# Altium project GS-1.PrjPcb
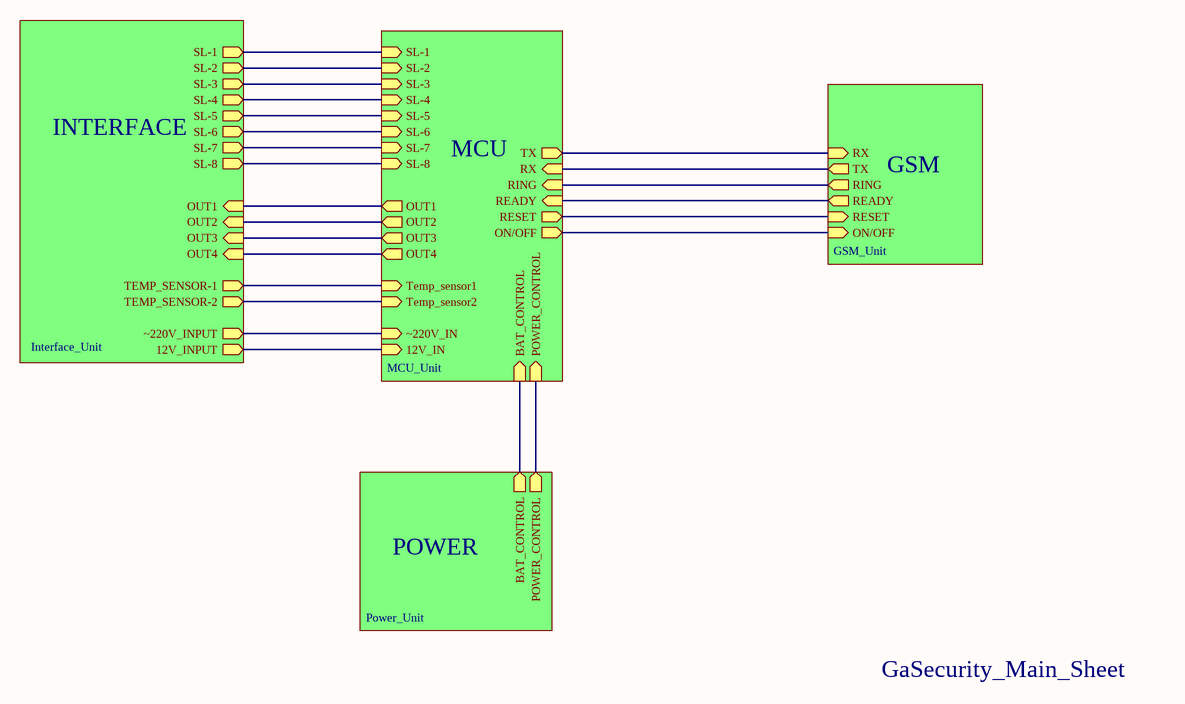
[diagram p0: GS-1.SchDoc]
5 sheets, 130 parts. Net scope: hierarchical (ports join the sheet entries above them; power ports are global).
Board file: GS-1.PcbDoc
Sheets:
  GS-1.SchDoc
    MCU = MCU_Unit.SchDoc
    POWER = Power_Unit.SchDoc
    GSM = GSM_Unit.SchDoc
    INTERFACE = Interface_Unit.SchDoc

## Sheet GS-1.SchDoc
size A4

### Sub-sheets
GSM = GSM_Unit: RX (in), TX (out), RING (out), READY (out), RESET (in), ON/OFF (in)
INTERFACE = Interface_Unit: SL-1 (out), SL-2 (out), SL-3 (out), SL-4 (out), SL-5 (out), SL-6 (out), SL-7 (out), SL-8 (out), OUT1 (in), OUT2 (in), OUT3 (in), OUT4 (in), TEMP_SENSOR-1 (out), TEMP_SENSOR-2 (out), ~220V_INPUT (out), 12V_INPUT (out)
MCU = MCU_Unit: TX (out), RX (in), ON/OFF (out), RESET (out), READY (in), RING (in), SL-1 (in), SL-2 (in), SL-3 (in), SL-4 (in), SL-5 (in), SL-6 (in), SL-7 (in), SL-8 (in), Temp_sensor1 (in), Temp_sensor2 (in), ~220V_IN (in), 12V_IN (in), OUT1 (out), OUT2 (out), OUT3 (out), OUT4 (out), BAT_CONTROL (in), POWER_CONTROL (in)
POWER = Power_Unit: POWER_CONTROL (out), BAT_CONTROL (out)

### Nets
NetC2_1: sheet MCU/12V_IN, sheet INTERFACE/12V_INPUT
NetC14_1: sheet MCU/POWER_CONTROL, sheet POWER/POWER_CONTROL
NetP17_2: sheet MCU/Temp_sensor1, sheet INTERFACE/TEMP_SENSOR-1
NetP18_2: sheet MCU/Temp_sensor2, sheet INTERFACE/TEMP_SENSOR-2
NetQ1_3: sheet MCU/RX, sheet GSM/TX
NetQ2_3: sheet MCU/TX, sheet GSM/RX
NetR5_1: sheet MCU/RESET, sheet GSM/RESET
NetR6_1: sheet MCU/ON/OFF, sheet GSM/ON/OFF
NetR9_2: sheet MCU/SL-5, sheet INTERFACE/SL-5
NetR10_2: sheet MCU/SL-1, sheet INTERFACE/SL-1
NetR23_1: sheet MCU/OUT3, sheet INTERFACE/OUT3
NetR24_1: sheet MCU/OUT4, sheet INTERFACE/OUT4
NetR25_2: sheet MCU/SL-6, sheet INTERFACE/SL-6
NetR26_2: sheet MCU/SL-2, sheet INTERFACE/SL-2
NetR27_1: sheet MCU/OUT1, sheet INTERFACE/OUT1
NetR28_1: sheet MCU/OUT2, sheet INTERFACE/OUT2
NetR32_2: sheet MCU/~220V_IN, sheet INTERFACE/~220V_INPUT
NetR35_2: sheet MCU/SL-7, sheet INTERFACE/SL-7
NetR36_2: sheet MCU/SL-3, sheet INTERFACE/SL-3
NetR42_2: sheet MCU/SL-8, sheet INTERFACE/SL-8
NetR43_2: sheet MCU/SL-4, sheet INTERFACE/SL-4
NetR54_1: sheet MCU/BAT_CONTROL, sheet POWER/BAT_CONTROL
NetU1_7: sheet MCU/READY, sheet GSM/READY
NetU1_45: sheet MCU/RING, sheet GSM/RING

### Notes on the sheet
- GaSecurity_Main_Sheet

## Sheet MCU_Unit.SchDoc
size A4
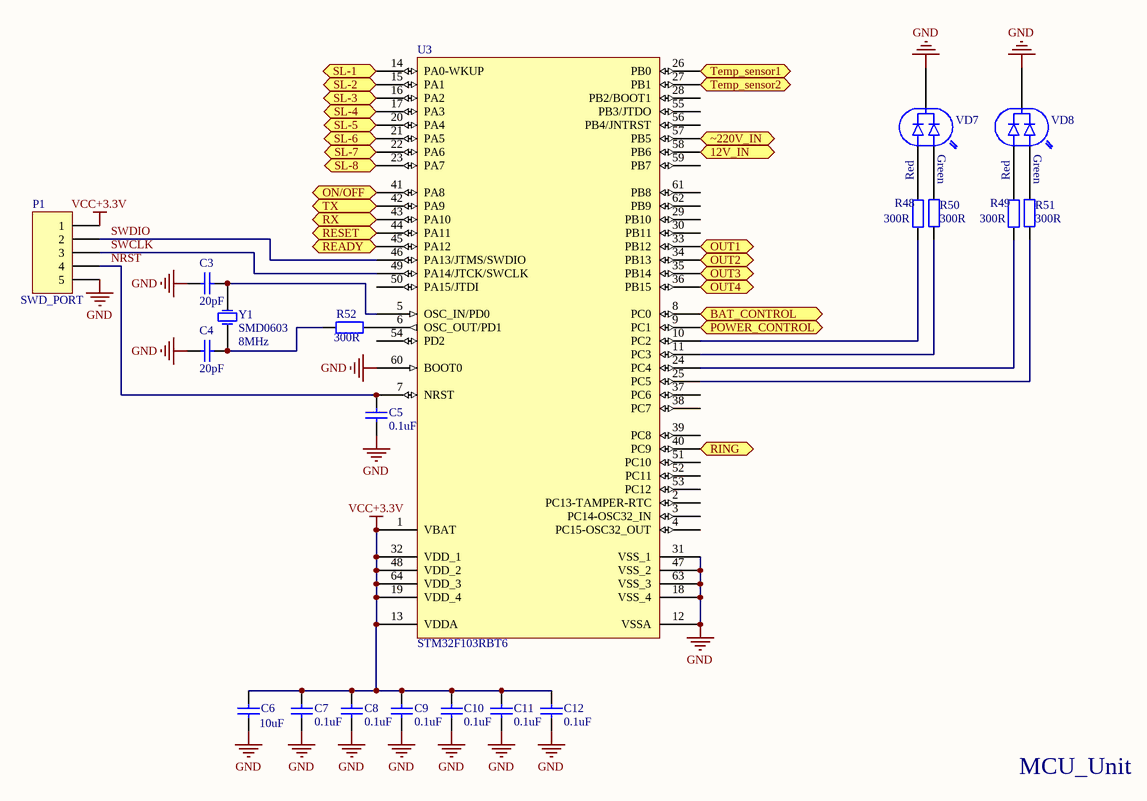
[diagram p1: MCU_Unit.SchDoc]

### Parts
C3  value 20pF  [C0603]  (hidden comment: CAP_SMD)
C4  value 20pF  [C0603]  (hidden comment: CAP_SMD)
C5  value 0.1uF  [C0603]  (hidden comment: CAP_SMD)
C6  value 10uF  [C1210]  (hidden comment: Cap Semi)
C7  value 0.1uF  [C0603]  (hidden comment: CAP_SMD)
C8  value 0.1uF  [C0603]  (hidden comment: CAP_SMD)
C9  value 0.1uF  [C0603]  (hidden comment: CAP_SMD)
C10  value 0.1uF  [C0603]  (hidden comment: CAP_SMD)
C11  value 0.1uF  [C0603]  (hidden comment: CAP_SMD)
C12  value 0.1uF  [C0603]  (hidden comment: CAP_SMD)
P1  SWD_PORT  [HDR1X5]
R48  value 300R  [C0603]  (hidden comment: RES_SMD)
R49  value 300R  [C0603]  (hidden comment: RES_SMD)
R50  value 300R  [C0603]  (hidden comment: RES_SMD)
R51  value 300R  [C0603]  (hidden comment: RES_SMD)
R52  value 300R  [C0603]  (hidden comment: RES_SMD)
U3  STM32F103RBT6  [LQFP64_N]
VD7  LIGHTDIODE2  [LIGHTDIODE2]  (value not drawn)
VD8  LIGHTDIODE2  [LIGHTDIODE2]  (value not drawn)
Y1  SMD0603  [Quartz_SMD0603]

### Ports
12V_IN (in), BAT_CONTROL (in), ON/OFF (out), OUT1 (out), OUT2 (out), OUT3 (out), OUT4 (out), POWER_CONTROL (in), READY (in), RESET (out), RING (in), RX (in), SL-1 (in), SL-2 (in), SL-3 (in), SL-4 (in), SL-5 (in), SL-6 (in), SL-7 (in), SL-8 (in), Temp_sensor1 (in), Temp_sensor2 (in), TX (out), ~220V_IN (in)

### Nets
GND: C3.1 C4.1 C5.2 C6.1 C7.2 C8.2 C9.2 C10.2 C11.2 C12.2 P1.5 U3.12(VSSA) U3.18(VSS_4) U3.31(VSS_1) U3.47(VSS_2) U3.60(BOOT0) U3.63(VSS_3) VD7.1 VD8.1
VCC+3.3V: C6.2 C7.1 C8.1 C9.1 C10.1 C11.1 C12.1 P1.1 U3.1(VBAT) U3.13(VDDA) U3.19(VDD_4) U3.32(VDD_1) U3.48(VDD_2) U3.64(VDD_3)
NRST: C5.1 P1.4 U3.7(NRST)
SWCLK: P1.3 U3.49(PA14/JTCK/SWCLK)
SWDIO: P1.2 U3.46(PA13/JTMS/SWDIO)
NetC2_1: U3.58(PB6) ; port 12V_IN
NetC3_2: C3.2 U3.5(OSC_IN/PD0) Y1.3(OSC2)
NetC4_2: C4.2 R52.1 Y1.1(OSC1)
NetC14_1: U3.9(PC1) ; port POWER_CONTROL
NetP17_2: U3.26(PB0) ; port Temp_sensor1
NetP18_2: U3.27(PB1) ; port Temp_sensor2
NetQ1_3: U3.43(PA10) ; port RX
NetQ2_3: U3.42(PA9) ; port TX
NetR5_1: U3.44(PA11) ; port RESET
NetR6_1: U3.41(PA8) ; port ON/OFF
NetR9_2: U3.20(PA4) ; port SL-5
NetR10_2: U3.14(PA0-WKUP) ; port SL-1
NetR23_1: U3.35(PB14) ; port OUT3
NetR24_1: U3.36(PB15) ; port OUT4
NetR25_2: U3.21(PA5) ; port SL-6
NetR26_2: U3.15(PA1) ; port SL-2
NetR27_1: U3.33(PB12) ; port OUT1
NetR28_1: U3.34(PB13) ; port OUT2
NetR32_2: U3.57(PB5) ; port ~220V_IN
NetR35_2: U3.22(PA6) ; port SL-7
NetR36_2: U3.16(PA2) ; port SL-3
NetR42_2: U3.23(PA7) ; port SL-8
NetR43_2: U3.17(PA3) ; port SL-4
NetR48_1: R48.1 U3.10(PC2)
NetR48_2: R48.2 VD7.3
NetR49_1: R49.1 U3.24(PC4)
NetR49_2: R49.2 VD8.3
NetR50_1: R50.1 U3.11(PC3)
NetR50_2: R50.2 VD7.2
NetR51_1: R51.1 U3.25(PC5)
NetR51_2: R51.2 VD8.2
NetR52_2: R52.2 U3.6(OSC_OUT/PD1)
NetR54_1: U3.8(PC0) ; port BAT_CONTROL
NetU1_7: U3.45(PA12) ; port READY
NetU1_45: U3.40(PC9) ; port RING

Not connected (* = marked no-connect by the designer): U3 2(PC13-TAMPER-RTC) 3(PC14-OSC32_IN) 4(PC15-OSC32_OUT) 28(PB2/BOOT1) 29(PB10) 30(PB11) 37(PC6) 38(PC7) 39(PC8) 50(PA15/JTDI) 51(PC10) 52(PC11) 53(PC12) 54(PD2) 55(PB3/JTDO) 56(PB4/JNTRST) 59(PB7) 61(PB8) 62(PB9)

### Notes on the sheet
- Green
- Red
- MCU_Unit
- (in symbol Quartz_SMD) 8MHz

### Library data of the parts
C3-C5 C7-C12 = Capasitor_SMD_0805: Capasitor_SMD_0808/
C6 = Cap Semi: Capacitor (Semiconductor SIM Model); Published: 8-Jun-2000; LatestRevisionDate: 29-May-2009; LatestRevisionNote: IPC-7351 Footprint Added.; PackageReference: C1206; Publisher: Altium Limited; PackageDescription: Chip Capacitor
P1 = Header 5: Header, 5-Pin; LatestRevisionDate: 17-Jul-2002; LatestRevisionNote: Re-released for DXP Platform.; Publisher: Altium Limited
R48-R52 = RES: Resistor
U3 = STM32F103RBT6: STM32 ARM-based 32-bit MCU with 128 Kbytes Flash, 64-pin LQFP, Industrial Temperature; Published: 30-May-2008; DatasheetVersion: rev6, Mar-2008; PackageVersion: Mar-2008; PackageReference: LQFP64; Publisher: Altium Limited; PackageDescription: 64-Pin Low-Profile Quad Flat Pack, 10 x 10 mm Body, 0.5 mm Pitch (LQFP64); ComponentLink1Description: Manufacturer Link; ComponentLink1URL: www.st.com/stm32; ComponentLink2Description: Datasheet; ComponentLink2URL: http://www.st.com/stonline/products/literature/ds/13587.pdf
Y1 = Quartz_SMD
VD7 VD8 = LIGHTDIODE2: Value: *

## Sheet Power_Unit.SchDoc
size A4
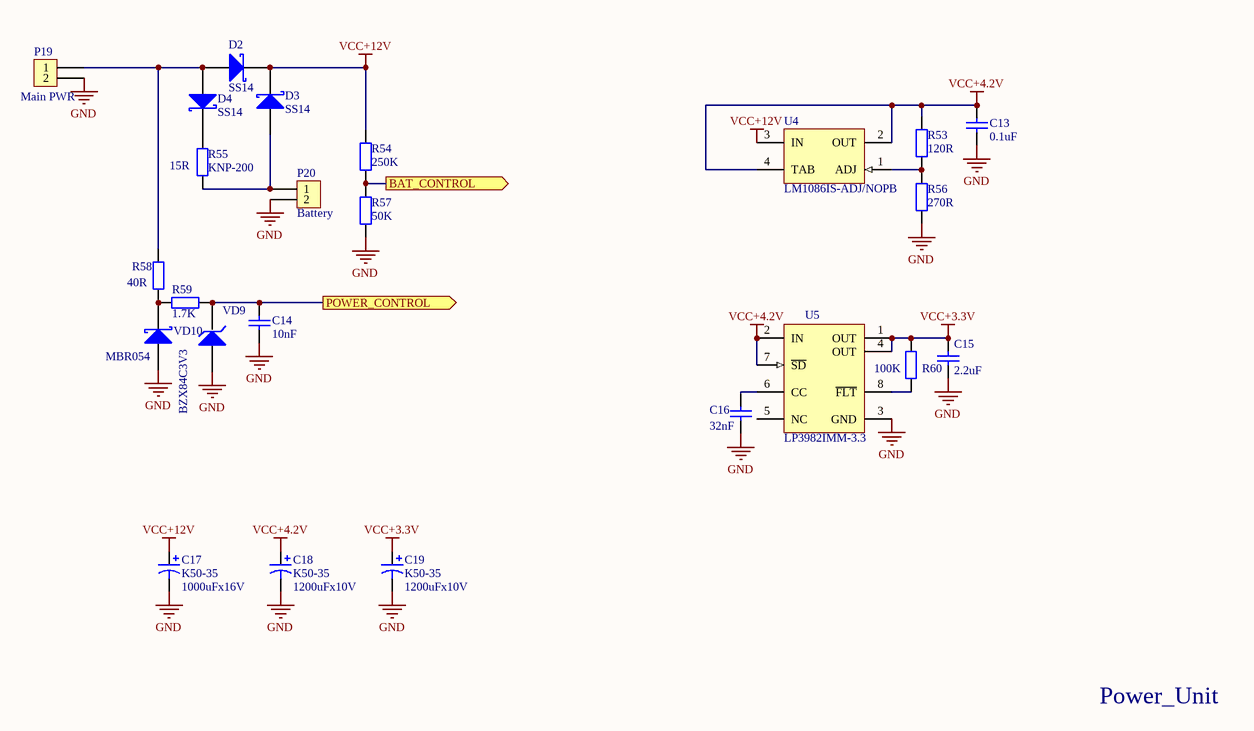
[diagram p2: Power_Unit.SchDoc]

### Parts
C13  value 0.1uF  [C0603]  (hidden comment: CAP_SMD)
C14  value 10nF  [C0603]  (hidden comment: 0805)
C15  value 2.2uF  [C0603]  (hidden comment: 0805)
C16  value 32nF  [C0603]  (hidden comment: 0805)
C17  K50-35  value 1000uFx16V  [CAP_POL_D10]
C18  K50-35  value 1200uFx10V  [CAP_POL_D10]
C19  K50-35  value 1200uFx10V  [CAP_POL_D10]
D2  SS14  [SMA_Diode]
D3  SS14  [SMA_Diode]
D4  SS14  [SMA_Diode]
P19  Main PWR  [WF 02M]
P20  Battery  [WF 02M]
R53  value 120R  [C0805]  (hidden comment: RES)
R54  value 250K  [C0603]  (hidden comment: RES_SMD)
R55  KNP-200  value 15R  [Resistor KNP-200]
R56  value 270R  [C0805]  (hidden comment: RES)
R57  value 50K  [C0603]  (hidden comment: RES_SMD)
R58  value 40R  [C0805]  (hidden comment: RES)
R59  value 1.7K  [C0805]  (hidden comment: RES)
R60  value 100K  [C0603]  (hidden comment: RES)
U4  LM1086IS-ADJ/NOPB  [TS3B_N]
U5  LP3982IMM-3.3  [MUA08A_N]
VD9  BZX84C3V3  [SOT23]
VD10  MBR054  [SOD-123]

### Ports
BAT_CONTROL (out), POWER_CONTROL (out)

### Nets
GND: C13.2 C14.2 C15.2 C16.2 C17.2 C18.2 C19.2 P19.2 P20.2 R56.1 R57.1 U5.3(GND) VD9.1(A) VD10.2(A)
VCC+3.3V: C15.1 C19.1 R60.2 U5.1(OUT) U5.4(OUT)
VCC+4.2V: C13.1 C18.1 R53.2 U4.2(OUT) U4.4(TAB) U5.2(IN) U5.7(~{SD})
VCC+12V: C17.1 D2.1(K) D3.1(K) R54.2 U4.3(IN)
NetC14_1: C14.1 R59.2 VD9.3(K) ; port POWER_CONTROL
NetC16_1: C16.1 U5.6(CC)
NetD2_2: D2.2(A) D4.2(A) P19.1 R58.2
NetD3_2: D3.2(A) P20.1 R55.1
NetD4_1: D4.1(K) R55.2
NetR53_1: R53.1 R56.2 U4.1(ADJ)
NetR54_1: R54.1 R57.2 ; port BAT_CONTROL
NetR58_1: R58.1 R59.1 VD10.1(K)
NetR60_1: R60.1 U5.8(~{FLT})

Not connected (* = marked no-connect by the designer): U5 5(NC); VD9 2

### Notes on the sheet
- Power_Unit

### Library data of the parts
C13-C16 = Capasitor_SMD_0805: Capasitor_SMD_0808/
C17-C19 = Capasitor_pol D10
P19 P20 = WF 02M
R53 R54 R56-R60 = RES: Resistor
R55 = Resistor 2W
U4 = LM1086IS-ADJ/NOPB: 1.5A Low Dropout Positive Regulators, 3-pin TO-263, Pb-Free; Manufacturer: National Semiconductor; PackageTopMarking: NSUZXYTTE#*LM1086*IS-ADJ; PowerWise: N; CompType: LDO IC; Published: 1-Mar-2010; DatasheetVersion: Jun-2005; PackageVersion: revF, Apr-2005; PackageReference: TS3B; Publisher: Altium Limited; PackageDescription: TO-263, Molded, .400 x .390 x .180in, 3 Lead, .1in Pitch, Surface Mount; Supplier 1: Digi-Key; Supplier Part Number 1: LM1086IS-ADJ-ND; Supplier 2: Farnell; Supplier Part Number 2: 1469045; PartNumber: LM1086IS-ADJ/NOPB; RoHS: Y; PinCount: 3; Code_JEDEC: MO-169-AA; ComponentLink1Description: LM1086 Datasheet; ComponentLink1URL: http://www.national.com/ds/LM/LM1086.pdf; ComponentLink2Description: LM1086 Web Page; ComponentLink2URL: http://www.national.com/pf/LM/LM1086.html; ComponentLink3Description: TS3B Package Page; ComponentLink3URL: http://www.national.com/packaging/folders/ts3b.html
U5 = LP3982IMM-3.3: Micropower, Ultra Low-Dropout, Low-Noise, 300mA CMOS Regulator, 8-pin Mini SOIC; Manufacturer: National Semiconductor; PackageTopMarking: ZXTT*LEUB; PowerWise: N; CompType: LDO IC; Published: 4-Dec-2008; DatasheetVersion: Mar-2006; PackageVersion: revF, Apr-2008; PackageReference: MUA08A; Publisher: Altium Limited; PackageDescription: MINI SOIC, .118 x .118 x .034in, 8 Lead, .0256in Pitch; Supplier 1: Farnell; Supplier Part Number 1: 9779590; PartNumber: LP3982IMM-3.3; RoHS: N; PinCount: 8; Code_JEDEC: MO-187-AA; ComponentLink1Description: LP3982 Datasheet; ComponentLink1URL: http://www.national.com/ds/LP/LP3982.pdf; ComponentLink2Description: LP3982 Web Page; ComponentLink2URL: http://www.national.com/pf/LP/LP3982.html; ComponentLink3Description: MUA08A Package Page; ComponentLink3URL: http://www.national.com/packaging/folders/mua08a.html
VD9 = BZX84C: Value: *

## Sheet GSM_Unit.SchDoc
size A4
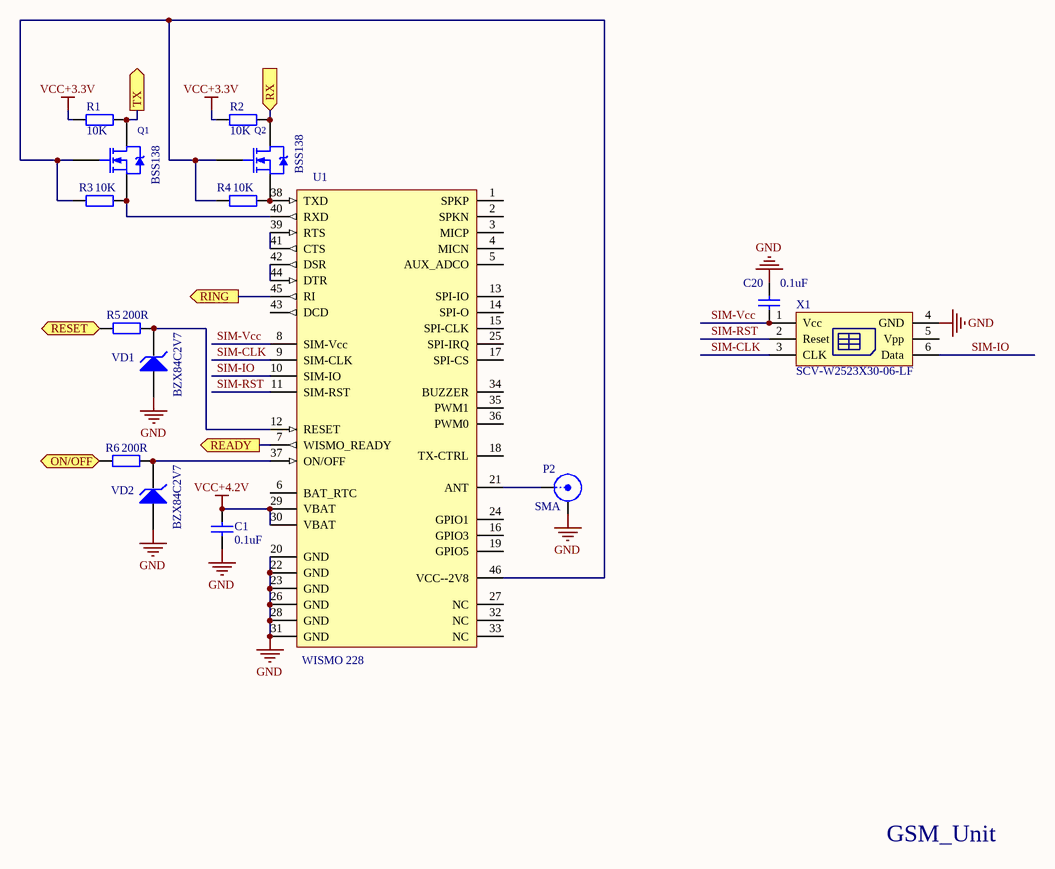
[diagram p3: GSM_Unit.SchDoc]

### Parts
C1  value 0.1uF  [C0603]  (hidden comment: CAP_SMD)
C20  value 0.1uF  [C0603]  (hidden comment: CAP_SMD)
P2  SMA  [SMA]
Q1  BSS138  [SOT23]
Q2  BSS138  [SOT23]
R1  value 10K  [C0603]  (hidden comment: RES_SMD)
R2  value 10K  [C0603]  (hidden comment: RES_SMD)
R3  value 10K  [C0603]  (hidden comment: RES_SMD)
R4  value 10K  [C0603]  (hidden comment: RES_SMD)
R5  value 200R  [C0603]  (hidden comment: RES_SMD)
R6  value 200R  [C0603]  (hidden comment: RES_SMD)
U1  WISMO 228  [WISMO]
VD1  BZX84C2V7  [SOT23]
VD2  BZX84C2V7  [SOT23]
X1  SCV-W2523X30-06-LF  [SCV-W2523X30-06-LF]

### Ports
ON/OFF (in), READY (out), RESET (in), RING (out), RX (in), TX (out)

### Nets
GND: C1.2 C20.1 P2.2(Y) U1.20(GND) U1.22(GND) U1.23(GND) U1.26(GND) U1.28(GND) U1.31(GND) VD1.1(A) VD2.1(A) X1.4(GND)
VCC+3.3V: R1.1 R2.1
VCC+4.2V: C1.1 U1.29(VBAT) U1.30(VBAT)
SIM-CLK: U1.9(SIM-CLK) X1.3(CLK)
SIM-IO: U1.10(SIM-IO) X1.6(Data)
SIM-RST: U1.11(SIM-RST) X1.2(Reset)
SIM-Vcc: C20.2 U1.8(SIM-Vcc) X1.1(Vcc)
NetP2_1: P2.1(X) U1.21(ANT)
NetQ1_1: Q1.1(G) Q2.1(G) R3.1 R4.1 U1.46(VCC--2V8)
NetQ1_2: Q1.2(S) R3.2 U1.40(RXD)
NetQ1_3: Q1.3(D) R1.2 ; port TX
NetQ2_2: Q2.2(S) R4.2 U1.38(TXD)
NetQ2_3: Q2.3(D) R2.2 ; port RX
NetR5_1: R5.1 ; port RESET
NetR5_2: R5.2 U1.12(RESET) VD1.3(K)
NetR6_1: R6.1 ; port ON/OFF
NetR6_2: R6.2 U1.37(ON/OFF) VD2.3(K)
NetU1_7: U1.7(WISMO_READY) ; port READY
NetU1_39: U1.39(RTS) U1.41(CTS)
NetU1_42: U1.42(DSR) U1.44(DTR)
NetU1_45: U1.45(RI) ; port RING

Not connected (* = marked no-connect by the designer): U1 1(SPKP) 2(SPKN) 3(MICP) 4(MICN) 5(AUX_ADCO) 6(BAT_RTC) 13(SPI-IO) 14(SPI-O) 15(SPI-CLK) 16(GPIO3) 17(SPI-CS) 18(TX-CTRL) 19(GPIO5) 24(GPIO1) 25(SPI-IRQ) 27(NC) 32(NC) 33(NC) 34(BUZZER) 35(PWM1) 36(PWM0) 43(DCD); VD1 2; VD2 2; X1 5(Vpp)

### Notes on the sheet
- GSM_Unit

### Library data of the parts
C1 C20 = Capasitor_SMD_0805: Capasitor_SMD_0808/
Q1 Q2 = BSS138-SOT23
R1-R6 = RES: Resistor
VD1 VD2 = BZX84C: Value: *
X1 = SCV-W2523X30-06-LF: SIM Cartreader
P2 = SMA: LatestRevisionDate: 17-Jul-2002; Publisher: Altium Limited; LatestRevisionNote: Re-released for DXP Platform.; Value: *

## Sheet Interface_Unit.SchDoc
size A4
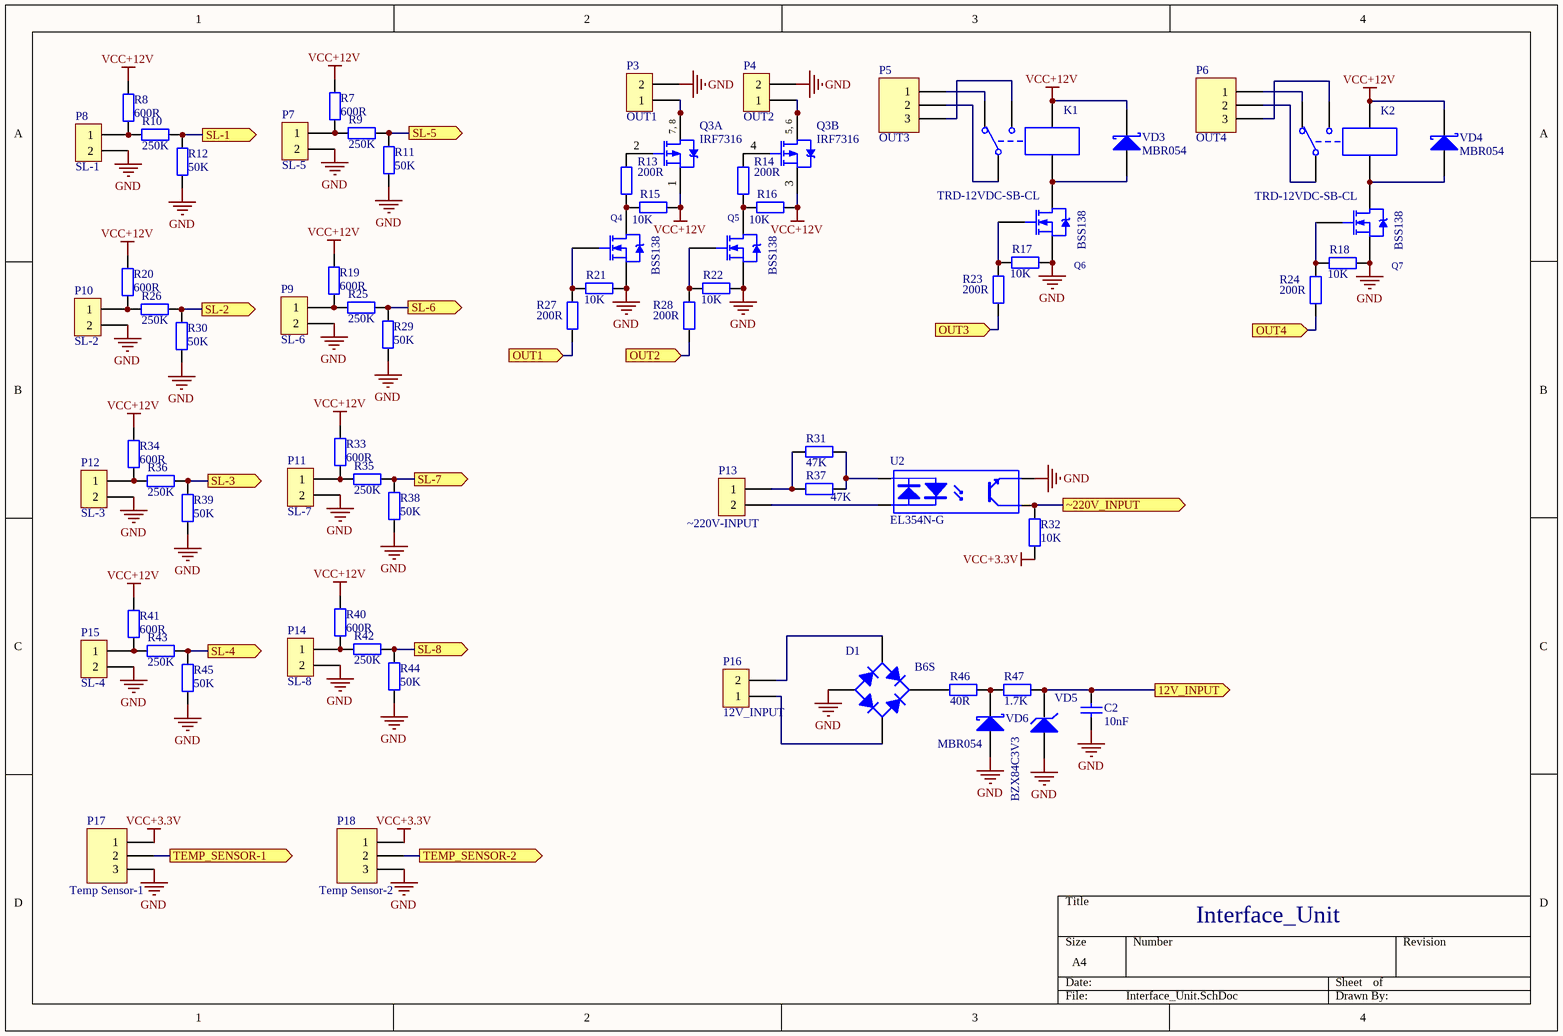
[diagram p4: Interface_Unit.SchDoc]

### Parts
C2  value 10nF  [C0603]  (hidden comment: 0805)
D1  B6S  [B6S]
K1  TRD-12VDC-SB-CL  [TRD-C Type]
K2  TRD-12VDC-SB-CL  [TRD-C Type]
P3  15EDGRC-3.5-02P  [15EDGRC-3.5-02P]  (value not drawn)
P4  15EDGRC-3.5-02P  [15EDGRC-3.5-02P]  (value not drawn)
P5  OUT3  [15EDGRC-3.5-03P]
P6  OUT4  [15EDGRC-3.5-03P]
P7  15EDGRC-3.5-02P  [15EDGRC-3.5-02P]  (value not drawn)
P8  15EDGRC-3.5-02P  [15EDGRC-3.5-02P]  (value not drawn)
P9  15EDGRC-3.5-02P  [15EDGRC-3.5-02P]  (value not drawn)
P10  15EDGRC-3.5-02P  [15EDGRC-3.5-02P]  (value not drawn)
P11  15EDGRC-3.5-02P  [15EDGRC-3.5-02P]  (value not drawn)
P12  15EDGRC-3.5-02P  [15EDGRC-3.5-02P]  (value not drawn)
P13  15EDGRC-3.5-02P  [15EDGRC-3.5-02P]  (value not drawn)
P14  15EDGRC-3.5-02P  [15EDGRC-3.5-02P]  (value not drawn)
P15  15EDGRC-3.5-02P  [15EDGRC-3.5-02P]  (value not drawn)
P16  15EDGRC-3.5-02P  [15EDGRC-3.5-02P]  (value not drawn)
P17  Temp Sensor-1  [15EDGRC-3.5-03P]
P18  Temp Sensor-2  [15EDGRC-3.5-03P]
Q3  IRF7316  [SO-8_N]  (parts A,B of 2)
Q4  BSS138  [SOT23]
Q5  BSS138  [SOT23]
Q6  BSS138  [SOT23]
Q7  BSS138  [SOT23]
R7  value 600R  [SMD-1206]  (hidden comment: RES_SMD)
R8  value 600R  [SMD-1206]  (hidden comment: RES_SMD)
R9  value 250K  [C0603]  (hidden comment: RES_SMD)
R10  value 250K  [C0603]  (hidden comment: RES_SMD)
R11  value 50K  [C0603]  (hidden comment: RES_SMD)
R12  value 50K  [C0603]  (hidden comment: RES_SMD)
R13  value 200R  [C0603]  (hidden comment: RES_SMD)
R14  value 200R  [C0603]  (hidden comment: RES_SMD)
R15  value 10K  [C0603]  (hidden comment: RES_SMD)
R16  value 10K  [C0603]  (hidden comment: RES_SMD)
R17  value 10K  [C0603]  (hidden comment: RES_SMD)
R18  value 10K  [C0603]  (hidden comment: RES_SMD)
R19  value 600R  [SMD-1206]  (hidden comment: RES_SMD)
R20  value 600R  [SMD-1206]  (hidden comment: RES_SMD)
R21  value 10K  [C0603]  (hidden comment: RES_SMD)
R22  value 10K  [C0603]  (hidden comment: RES_SMD)
R23  value 200R  [C0603]  (hidden comment: RES_SMD)
R24  value 200R  [C0603]  (hidden comment: RES_SMD)
R25  value 250K  [C0603]  (hidden comment: RES_SMD)
R26  value 250K  [C0603]  (hidden comment: RES_SMD)
R27  value 200R  [C0603]  (hidden comment: RES_SMD)
R28  value 200R  [C0603]  (hidden comment: RES_SMD)
R29  value 50K  [C0603]  (hidden comment: RES_SMD)
R30  value 50K  [C0603]  (hidden comment: RES_SMD)
R31  value 47K  [SMD-2512]  (hidden comment: RES_SMD)
R32  value 10K  [C0603]  (hidden comment: RES_SMD)
R33  value 600R  [SMD-1206]  (hidden comment: RES_SMD)
R34  value 600R  [SMD-1206]  (hidden comment: RES_SMD)
R35  value 250K  [C0603]  (hidden comment: RES_SMD)
R36  value 250K  [C0603]  (hidden comment: RES_SMD)
R37  value 47K  [SMD-2512]  (hidden comment: RES_SMD)
R38  value 50K  [C0603]  (hidden comment: RES_SMD)
R39  value 50K  [C0603]  (hidden comment: RES_SMD)
R40  value 600R  [SMD-1206]  (hidden comment: RES_SMD)
R41  value 600R  [SMD-1206]  (hidden comment: RES_SMD)
R42  value 250K  [C0603]  (hidden comment: RES_SMD)
R43  value 250K  [C0603]  (hidden comment: RES_SMD)
R44  value 50K  [C0603]  (hidden comment: RES_SMD)
R45  value 50K  [C0603]  (hidden comment: RES_SMD)
R46  value 40R  [C0805]  (hidden comment: RES)
R47  value 1.7K  [C0805]  (hidden comment: RES)
U2  EL354N-G  [EL354N-G]
VD3  MBR054  [SOD-123]
VD4  MBR054  [SOD-123]
VD5  BZX84C3V3  [SOT23]
VD6  MBR054  [SOD-123]

### Ports
12V_INPUT (out), OUT1 (in), OUT2 (in), OUT3 (in), OUT4 (in), SL-1 (out), SL-2 (out), SL-3 (out), SL-4 (out), SL-5 (out), SL-6 (out), SL-7 (out), SL-8 (out), TEMP_SENSOR-1 (out), TEMP_SENSOR-2 (out), ~220V_INPUT (out)

### Nets
GND: C2.2 D1.3(A) P3.2 P4.2 P7.2 P8.2 P9.2 P10.2 P11.2 P12.2 P14.2 P15.2 P17.3 P18.3 Q4.2(S) Q5.2(S) Q6.2(S) Q7.2(S) R11.1 R12.1 R17.2 R18.2 R21.2 R22.2 R29.1 R30.1 R38.1 R39.1 R44.1 R45.1 U2.3 VD5.1(A) VD6.2(A)
VCC+3.3V: P17.1 P18.1 R32.1
VCC+12V: K1.2 K2.2 Q3.1(S) Q3.3(S) R7.2 R8.2 R15.2 R16.2 R19.2 R20.2 R33.2 R34.2 R40.2 R41.2 VD3.1(K) VD4.1(K)
NetC2_1: C2.1 R47.2 VD5.3(K) ; port 12V_INPUT
NetD1_1: D1.1(K) R46.1
NetD1_2: D1.2(C) P16.1
NetD1_4: D1.4(C) P16.2
NetK1_1: K1.1 Q6.3(D) VD3.2(A)
NetK1_3: K1.3 P5.2
NetK1_4: K1.4 P5.1
NetK1_5: K1.5 P5.3
NetK2_1: K2.1 Q7.3(D) VD4.2(A)
NetK2_3: K2.3 P6.2
NetK2_4: K2.4 P6.1
NetK2_5: K2.5 P6.3
NetP3_1: P3.1 Q3.7(D) Q3.8(D)
NetP4_1: P4.1 Q3.5(D) Q3.6(D)
NetP7_1: P7.1 R7.1 R9.1
NetP8_1: P8.1 R8.1 R10.1
NetP9_1: P9.1 R19.1 R25.1
NetP10_1: P10.1 R20.1 R26.1
NetP11_1: P11.1 R33.1 R35.1
NetP12_1: P12.1 R34.1 R36.1
NetP13_1: P13.1 R31.1 R37.1
NetP13_2: P13.2 U2.1
NetP14_1: P14.1 R40.1 R42.1
NetP15_1: P15.1 R41.1 R43.1
NetP17_2: P17.2 ; port TEMP_SENSOR-1
NetP18_2: P18.2 ; port TEMP_SENSOR-2
NetQ3_2: Q3.2(G) R13.2
NetQ3_4: Q3.4(G) R14.2
NetQ4_1: Q4.1(G) R21.1 R27.2
NetQ4_3: Q4.3(D) R13.1 R15.1
NetQ5_1: Q5.1(G) R22.1 R28.2
NetQ5_3: Q5.3(D) R14.1 R16.1
NetQ6_1: Q6.1(G) R17.1 R23.2
NetQ7_1: Q7.1(G) R18.1 R24.2
NetR9_2: R9.2 R11.2 ; port SL-5
NetR10_2: R10.2 R12.2 ; port SL-1
NetR23_1: R23.1 ; port OUT3
NetR24_1: R24.1 ; port OUT4
NetR25_2: R25.2 R29.2 ; port SL-6
NetR26_2: R26.2 R30.2 ; port SL-2
NetR27_1: R27.1 ; port OUT1
NetR28_1: R28.1 ; port OUT2
NetR31_2: R31.2 R37.2 U2.2
NetR32_2: R32.2 U2.4 ; port ~220V_INPUT
NetR35_2: R35.2 R38.2 ; port SL-7
NetR36_2: R36.2 R39.2 ; port SL-3
NetR42_2: R42.2 R44.2 ; port SL-8
NetR43_2: R43.2 R45.2 ; port SL-4
NetR46_2: R46.2 R47.1 VD6.1(K)

Not connected (* = marked no-connect by the designer): VD5 2

### Notes on the sheet
- Interface_Unit
- (in symbol 15EDGRC-3.5-02P) SL-1; SL-2; SL-3; SL-4; SL-5; SL-6; SL-7; SL-8; OUT1; OUT2; |20V-INPUT; 12V_INPUT
- (in symbol IRF7316, part A) 7, 8
- (in symbol IRF7316, part B) 5, 6

### Library data of the parts
C2 = Capasitor_SMD_0805: Capasitor_SMD_0808/
D1 = B6S: Diode Bridge
P5 P6 P17 P18 = 15EDGRC-3.5-03P
Q3 = IRF7316: HEXFET Power MOSFET; Published: 8-Jun-2000; LatestRevisionDate: 13-Apr-2006; LatestRevisionNote: IPC-7351 Footprint Added.; DatasheetVersion: Aug-1997; PackageVersion: Feb-2001; PackageReference: SO-8; Publisher: Altium Limited; PackageDescription: 8-Pin Plastic Small Outline Integrated Circuit 1.27 mm Pitch; Code_JEDEC: MS-012-AA; Code_IPC: SOIC127P600-8; ComponentLink1Description: Manufacturer Link; ComponentLink1URL: http://www.irf.com/; ComponentLink2Description: Datasheet; ComponentLink2URL: http://www.irf.com/product-info/datasheets/data/irf7316.pdf
Q4-Q7 = BSS138-SOT23
R7-R47 = RES: Resistor
U2 = EL354N
VD5 = BZX84C: Value: *

## Nets that join several sheets
GND: MCU_Unit (19 pins), Power_Unit (14 pins), GSM_Unit (12 pins), Interface_Unit (33 pins)
VCC+3.3V: MCU_Unit (14 pins), Power_Unit (5 pins), GSM_Unit (R1.1 R2.1), Interface_Unit (P17.1 P18.1 R32.1)
VCC+4.2V: Power_Unit (7 pins), GSM_Unit (C1.1 U1.29 U1.30)
VCC+12V: Power_Unit (5 pins), Interface_Unit (16 pins)
NetC2_1: MCU_Unit (U3.58), Interface_Unit (C2.1 R47.2 VD5.3)
NetC14_1: MCU_Unit (U3.9), Power_Unit (C14.1 R59.2 VD9.3)
NetP17_2: MCU_Unit (U3.26), Interface_Unit (P17.2)
NetP18_2: MCU_Unit (U3.27), Interface_Unit (P18.2)
NetQ1_3: MCU_Unit (U3.43), GSM_Unit (Q1.3 R1.2)
NetQ2_3: MCU_Unit (U3.42), GSM_Unit (Q2.3 R2.2)
NetR5_1: MCU_Unit (U3.44), GSM_Unit (R5.1)
NetR6_1: MCU_Unit (U3.41), GSM_Unit (R6.1)
NetR9_2: MCU_Unit (U3.20), Interface_Unit (R9.2 R11.2)
NetR10_2: MCU_Unit (U3.14), Interface_Unit (R10.2 R12.2)
NetR23_1: MCU_Unit (U3.35), Interface_Unit (R23.1)
NetR24_1: MCU_Unit (U3.36), Interface_Unit (R24.1)
NetR25_2: MCU_Unit (U3.21), Interface_Unit (R25.2 R29.2)
NetR26_2: MCU_Unit (U3.15), Interface_Unit (R26.2 R30.2)
NetR27_1: MCU_Unit (U3.33), Interface_Unit (R27.1)
NetR28_1: MCU_Unit (U3.34), Interface_Unit (R28.1)
NetR32_2: MCU_Unit (U3.57), Interface_Unit (R32.2 U2.4)
NetR35_2: MCU_Unit (U3.22), Interface_Unit (R35.2 R38.2)
NetR36_2: MCU_Unit (U3.16), Interface_Unit (R36.2 R39.2)
NetR42_2: MCU_Unit (U3.23), Interface_Unit (R42.2 R44.2)
NetR43_2: MCU_Unit (U3.17), Interface_Unit (R43.2 R45.2)
NetR54_1: MCU_Unit (U3.8), Power_Unit (R54.1 R57.2)
NetU1_7: MCU_Unit (U3.45), GSM_Unit (U1.7)
NetU1_45: MCU_Unit (U3.40), GSM_Unit (U1.45)